# EAGLE design board (EAGLE 9.5.1)
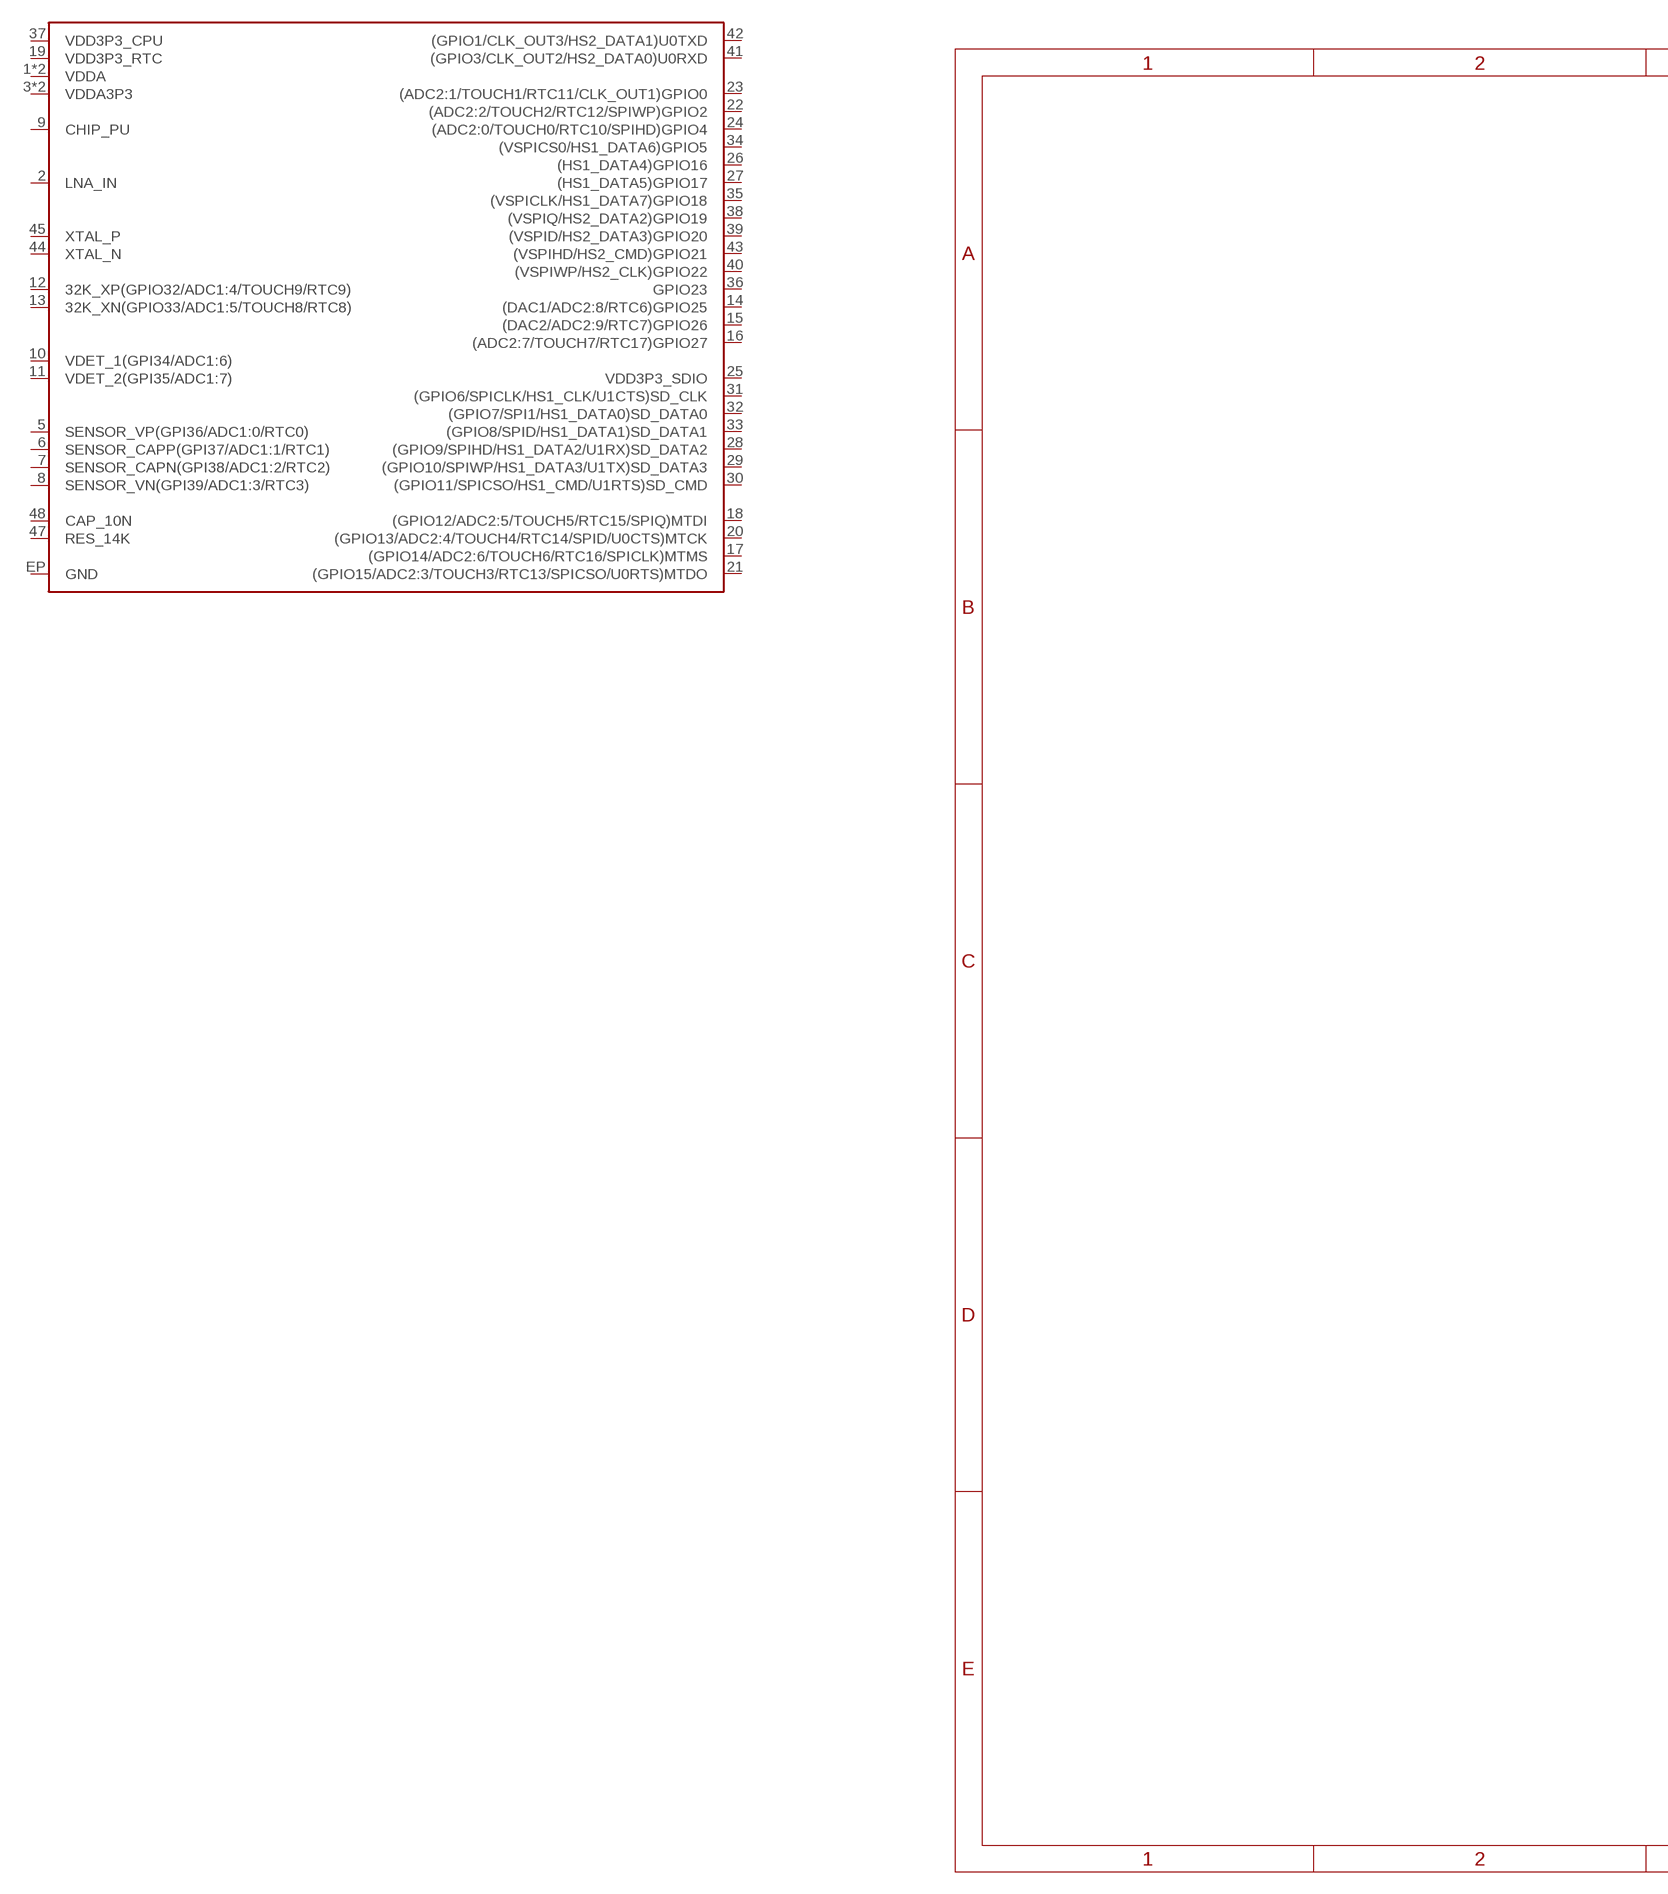
[diagram p0: schematic, sheet 1, part 1 of 2]
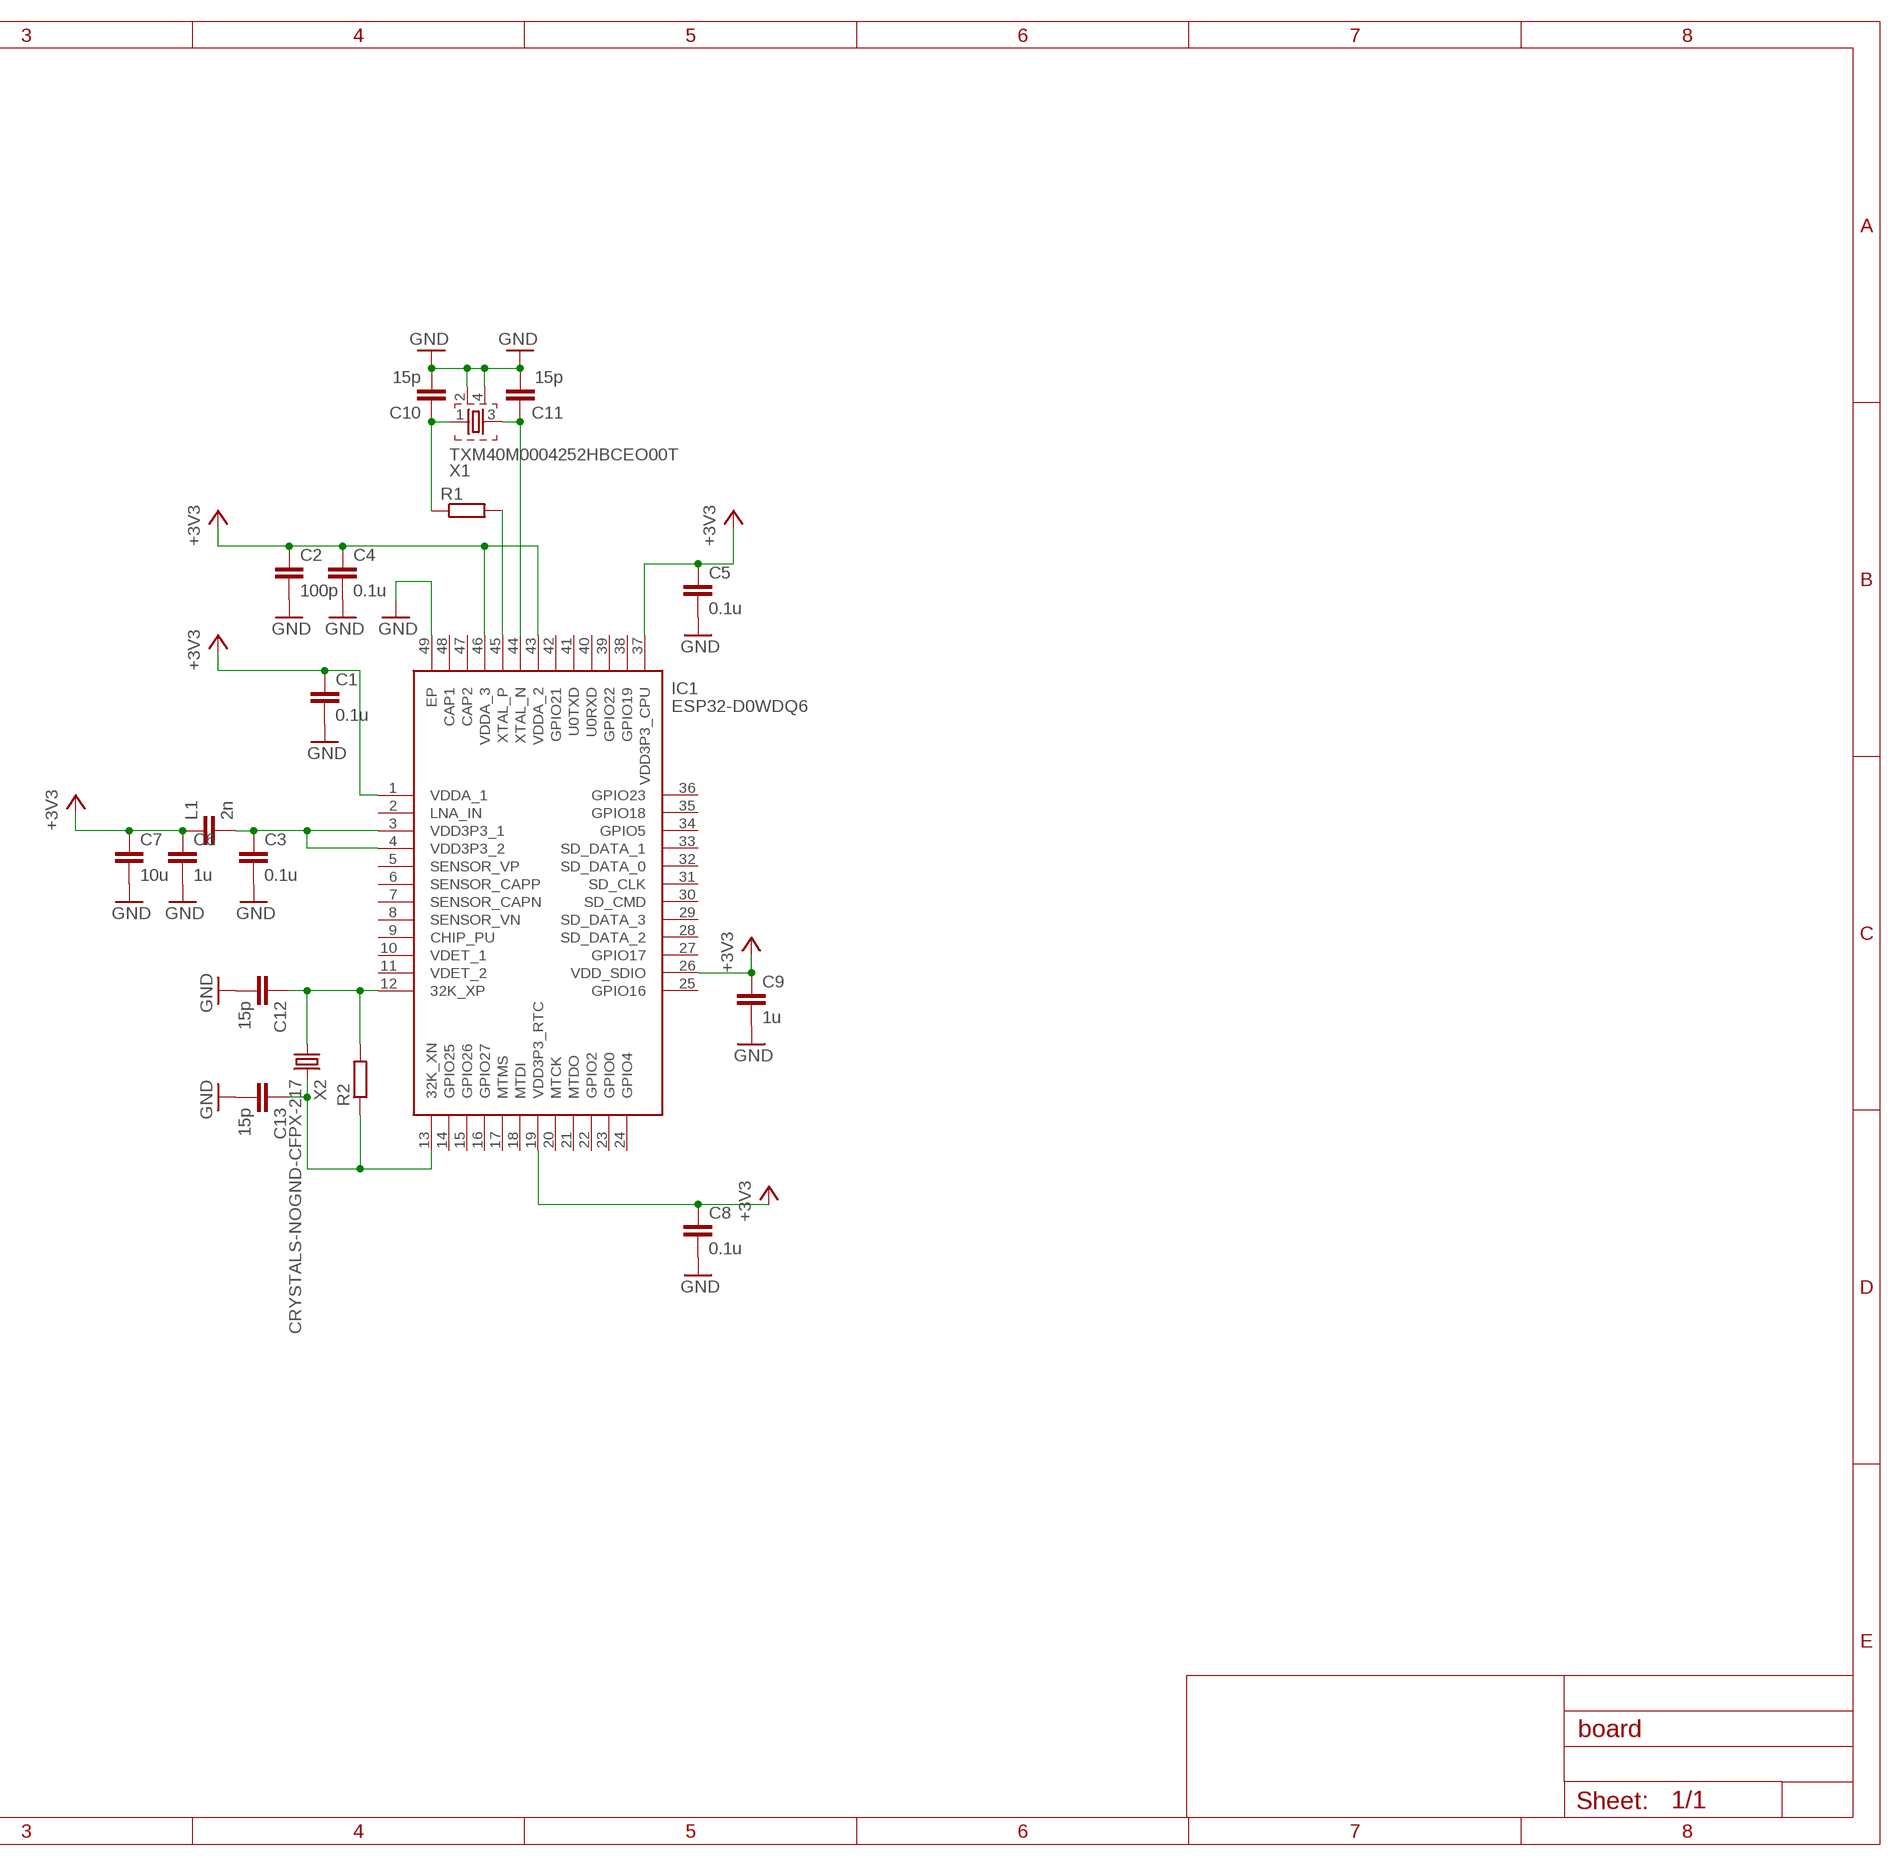
[diagram p1: schematic, sheet 1, part 2 of 2]

## Parts
C1  0.1u  C-EUC0402  [C0402]
C2  100p  C-EUC0402  [C0402]
C3  0.1u  C-EUC0402  [C0402]
C4  0.1u  C-EUC0402  [C0402]
C5  0.1u  C-EUC0402  [C0402]
C6  1u  C-EUC0402  [C0402]
C7  10u  C-EUC0603  [C0603]
C8  0.1u  C-EUC0402  [C0402]
C9  1u  C-EUC0402  [C0402]
C10  15p  C-EUC0402  [C0402]
C11  15p  C-EUC0402  [C0402]
C12  15p  C-EUC0402  [C0402]
C13  15p  C-EUC0402  [C0402]
IC1  ESP32-D0WDQ6  [QFN40P600X600X90-49N]
L1  2n  C-EUC0402K  [C0402K]
R1  R-EU_R0402  [R0402]
R2  R-EU_R0402  [R0402]
U$1  ESP32  [QFN48-0.4MM]
X1  TXM40M0004252HBCEO00T  CRYSTALS-GND-LID-CFPX-181  [2.5X2-4-PAD]
X2  CRYSTALS-NOGND-CFPX-217  [3.2X1.5-2-PAD]

## Nets
+3V3: C1.1 C2.1 C4.1 C5.1 C6.1 C7.1 C8.1 C9.1 IC1.1(VDDA_1) IC1.19(VDD3P3_RTC) IC1.26(VDD_SDIO) IC1.37(VDD3P3_CPU) IC1.43(VDDA_2) IC1.46(VDDA_3) L1.1
GND: C1.2 C2.2 C3.2 C4.2 C5.2 C6.2 C7.2 C8.2 C9.2 C10.2 C11.2 C12.2 C13.2 IC1.49(EP) X1.2 X1.4
N$2: C10.1 R1.1 X1.1
N$3: C3.1 IC1.3(VDD3P3_1) IC1.4(VDD3P3_2) L1.2
N$4: C11.1 IC1.44(XTAL_N) X1.3
N$5: IC1.45(XTAL_P) R1.2
N$6: C12.1 IC1.12(32K_XP) R2.2 X2.1
N$7: C13.1 IC1.13(32K_XN) R2.1 X2.2
Unconnected: IC1.2(LNA_IN) IC1.5(SENSOR_VP) IC1.6(SENSOR_CAPP) IC1.7(SENSOR_CAPN) IC1.8(SENSOR_VN) IC1.9(CHIP_PU) IC1.10(VDET_1) IC1.11(VDET_2) IC1.14(GPIO25) IC1.15(GPIO26) IC1.16(GPIO27) IC1.17(MTMS) IC1.18(MTDI) IC1.20(MTCK) IC1.21(MTDO) IC1.22(GPIO2) IC1.23(GPIO0) IC1.24(GPIO4) IC1.25(GPIO16) IC1.27(GPIO17) IC1.28(SD_DATA_2) IC1.29(SD_DATA_3) IC1.30(SD_CMD) IC1.31(SD_CLK) IC1.32(SD_DATA_0) IC1.33(SD_DATA_1) IC1.34(GPIO5) IC1.35(GPIO18) IC1.36(GPIO23) IC1.38(GPIO19) IC1.39(GPIO22) IC1.40(U0RXD) IC1.41(U0TXD) IC1.42(GPIO21) IC1.47(CAP2) IC1.48(CAP1) U$1.1(VDDA) U$1.2(LNA_IN) U$1.3(VDDA3P3) U$1.4(VDDA3P3) U$1.5(SENSOR_VP(GPI36/ADC1:0/RTC0)) U$1.6(SENSOR_CAPP(GPI37/ADC1:1/RTC1)) U$1.7(SENSOR_CAPN(GPI38/ADC1:2/RTC2)) U$1.8(SENSOR_VN(GPI39/ADC1:3/RTC3)) U$1.9(CHIP_PU) U$1.10(VDET_1(GPI34/ADC1:6)) U$1.11(VDET_2(GPI35/ADC1:7)) U$1.12(32K_XP(GPIO32/ADC1:4/TOUCH9/RTC9)) U$1.13(32K_XN(GPIO33/ADC1:5/TOUCH8/RTC8)) U$1.14((DAC1/ADC2:8/RTC6)GPIO25) U$1.15((DAC2/ADC2:9/RTC7)GPIO26) U$1.16((ADC2:7/TOUCH7/RTC17)GPIO27) U$1.17((GPIO14/ADC2:6/TOUCH6/RTC16/SPICLK)MTMS) U$1.18((GPIO12/ADC2:5/TOUCH5/RTC15/SPIQ)MTDI) U$1.19(VDD3P3_RTC) U$1.20((GPIO13/ADC2:4/TOUCH4/RTC14/SPID/U0CTS)MTCK) U$1.21((GPIO15/ADC2:3/TOUCH3/RTC13/SPICSO/U0RTS)MTDO) U$1.22((ADC2:2/TOUCH2/RTC12/SPIWP)GPIO2) U$1.23((ADC2:1/TOUCH1/RTC11/CLK_OUT1)GPIO0) U$1.24((ADC2:0/TOUCH0/RTC10/SPIHD)GPIO4) U$1.25(VDD3P3_SDIO) U$1.26((HS1_DATA4)GPIO16) U$1.27((HS1_DATA5)GPIO17) U$1.28((GPIO9/SPIHD/HS1_DATA2/U1RX)SD_DATA2) U$1.29((GPIO10/SPIWP/HS1_DATA3/U1TX)SD_DATA3) U$1.30((GPIO11/SPICSO/HS1_CMD/U1RTS)SD_CMD) U$1.31((GPIO6/SPICLK/HS1_CLK/U1CTS)SD_CLK) U$1.32((GPIO7/SPI1/HS1_DATA0)SD_DATA0) U$1.33((GPIO8/SPID/HS1_DATA1)SD_DATA1) U$1.34((VSPICS0/HS1_DATA6)GPIO5) U$1.35((VSPICLK/HS1_DATA7)GPIO18) U$1.36(GPIO23) U$1.37(VDD3P3_CPU) U$1.38((VSPIQ/HS2_DATA2)GPIO19) U$1.39((VSPID/HS2_DATA3)GPIO20) U$1.40((VSPIWP/HS2_CLK)GPIO22) U$1.41((GPIO3/CLK_OUT2/HS2_DATA0)U0RXD) U$1.42((GPIO1/CLK_OUT3/HS2_DATA1)U0TXD) U$1.43((VSPIHD/HS2_CMD)GPIO21) U$1.44(XTAL_N) U$1.45(XTAL_P) U$1.46(VDDA) U$1.47(RES_14K) U$1.48(CAP_10N) U$1.EP(GND)

## Library data of the parts
C1-C13 L1 = rcl:C-EU: CAPACITOR, European symbol; SPICEPREFIX: C
IC1 = SamacSys_Parts:ESP32-D0WDQ6: RF System on a Chip - SoC SMD IC ESP32-D0WDQ6, Dual Core MCU, WiFi & Bluetooth Combo, QFN48-pin, 6x6mm Source: Datasheet <https://componentsearchengine.com/Datasheets/1/ESP32-D0WDQ6.pdf>; DESCRIPTION: RF System on a Chip - SoC SMD IC ESP32-D0WDQ6, Dual Core MCU, WiFi & Bluetooth Combo, QFN48-pin, 6x6mm; HEIGHT: 0.9mm; MANUFACTURER_NAME: Espressif Systems; MANUFACTURER_PART_NUMBER: ESP32-D0WDQ6; MOUSER_PART_NUMBER: 356-ESP32-D0WDQ6; MOUSER_PRICE-STOCK: https://www.mouser.co.uk/ProductDetail/Espressif-Systems/ESP32-D0WDQ6?qs=chTDxNqvsykWgzfXx0gR%252BQ%3D%3D
R1 R2 = rcl:R-EU_: RESISTOR, European symbol; SPICEPREFIX: R
U$1 = esp32:ESP32
X1 = IQD-Frequency-Products:CRYSTALS-GND-LID: CRYSTALS WITH CAN GROUNDED
X2 = IQD-Frequency-Products:CRYSTALS-NOGND: CRYSTALS CAN NOT GROUNDED

## Board
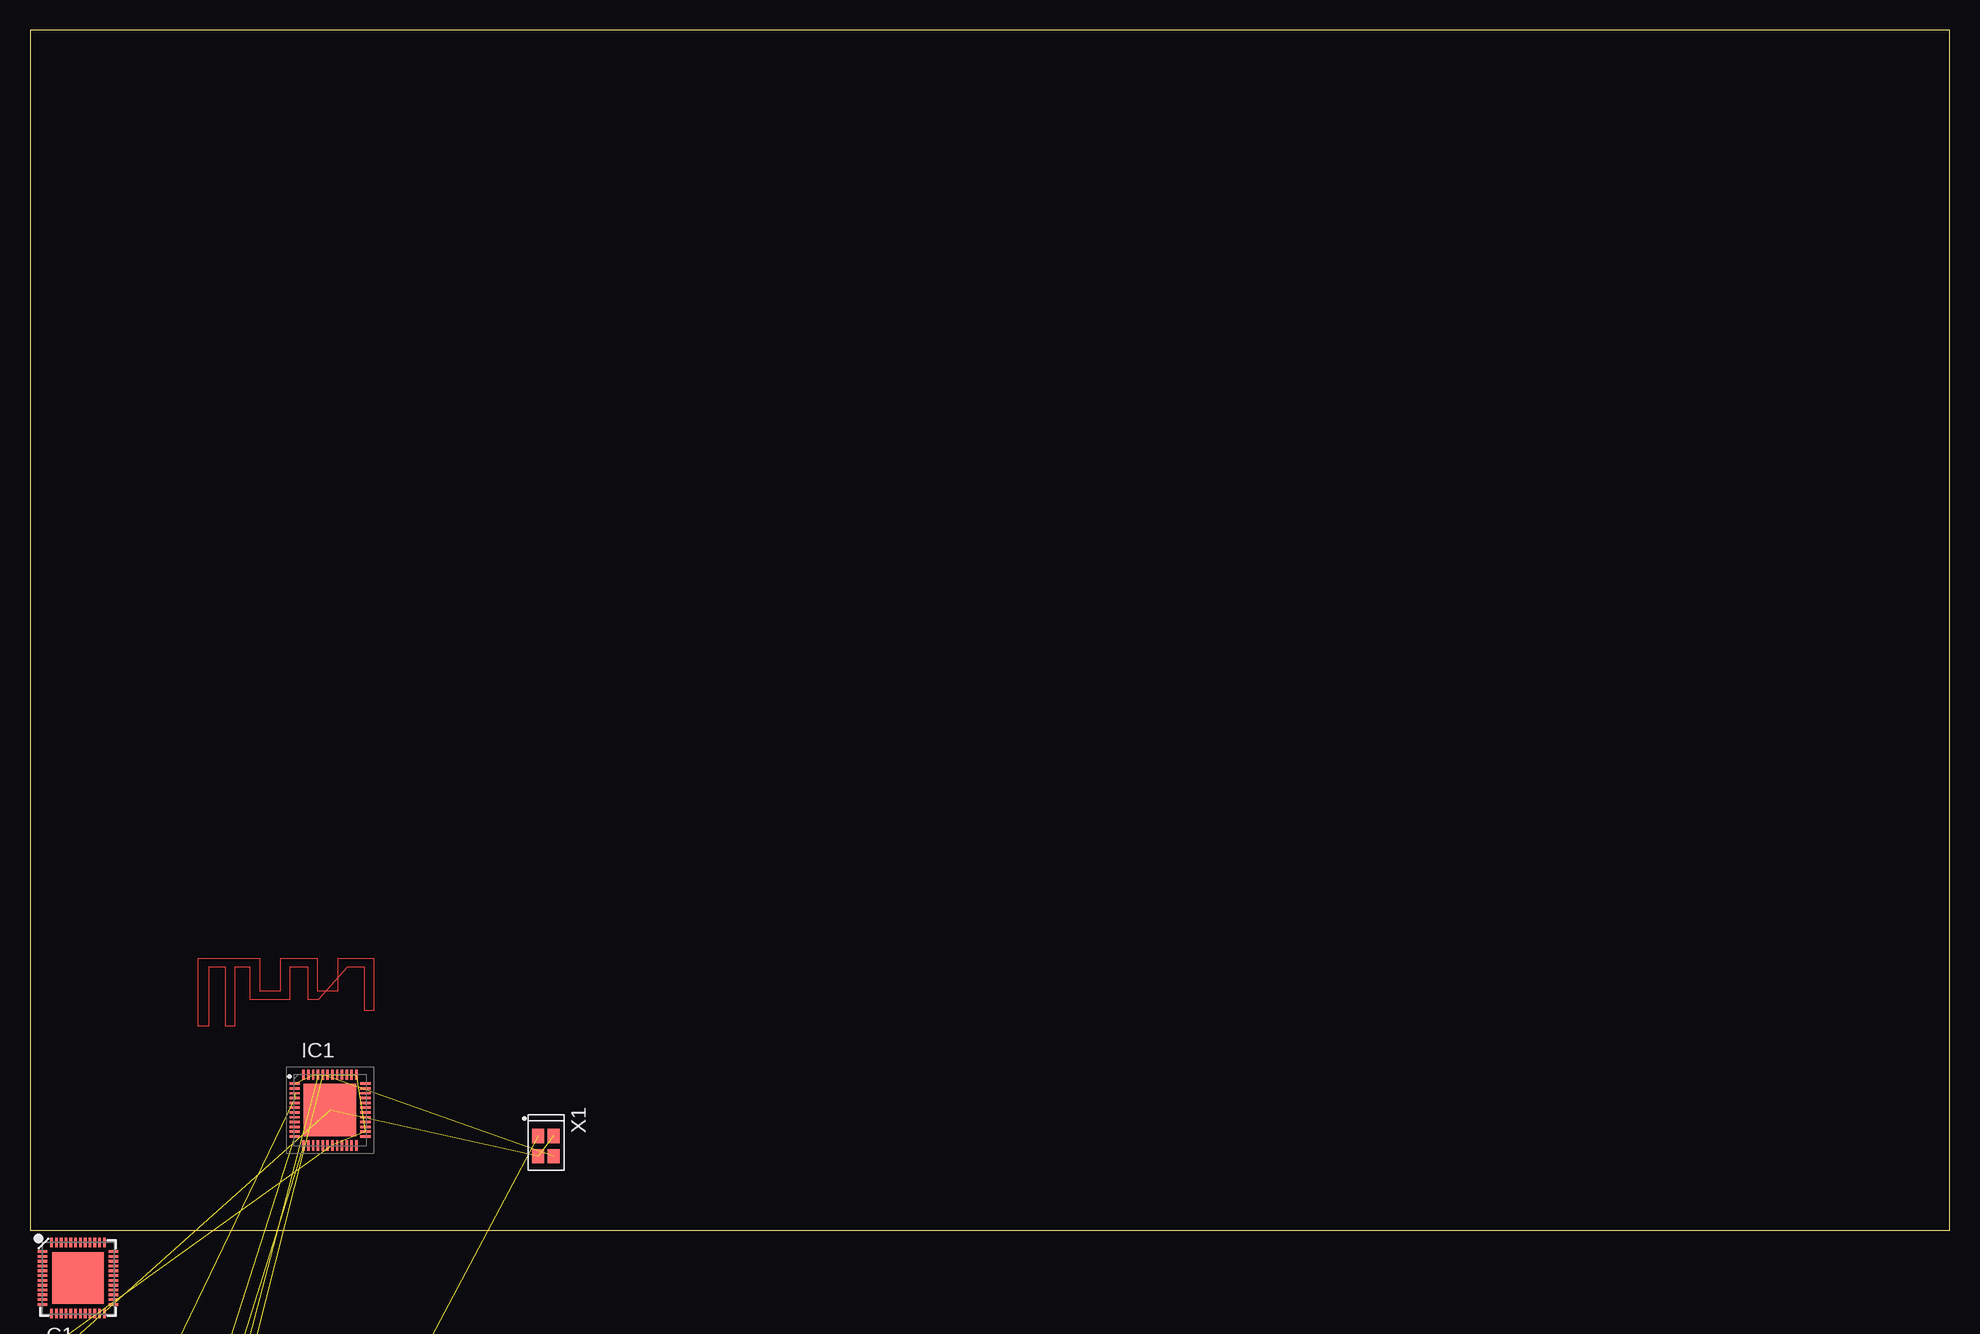
[diagram p2: board, top side]

Size 160 x 100 mm. Coordinates in mm from the lower left corner, seen from the top.
Outline: 0,0 160,0 160,100 0,100 0,0
Copper layers (1+2*15+16): Top 0.035mm / dielectric 1.5mm / Route2 0.035mm / dielectric 0.15mm / Route15 0.035mm / dielectric 0.2mm / Bottom 0.035mm
Design rules "default *": minimum track width 6mil, minimum drill 0.35mm, track to track 0.15mm, track to pad 0.15mm, pad to pad 0.15mm, via to via 0.15mm, smd to smd 0.15mm, copper to edge 40mil, drill to drill 6mil, minimum pad ring 10mil, minimum via ring 8mil, stop-mask expansion 4mil, vias tented up to drill 0mil, thermal gap 10mil

### Footprints (pad centres in the part's own frame; a part is rotated, then mirrored left to right if it is on the bottom)
C0402 = smd 0.7 x 0.9: 1 -0.65,0; 2 0.65,0
C0603 = smd 1.1 x 1: 1 -0.85,0; 2 0.85,0
QFN40P600X600X90-49N = smd 0.85 x 0.2: 1 -2.95,2.2; 2 -2.95,1.8; 3 -2.95,1.4; 4 -2.95,1; 5 -2.95,0.6; 6 -2.95,0.2; 7 -2.95,-0.2; 8 -2.95,-0.6; 9 -2.95,-1; 10 -2.95,-1.4; 11 -2.95,-1.8; 12 -2.95,-2.2; 25 2.95,-2.2; 26 2.95,-1.8; 27 2.95,-1.4; 28 2.95,-1; 29 2.95,-0.6; 30 2.95,-0.2; 31 2.95,0.2; 32 2.95,0.6; 33 2.95,1; 34 2.95,1.4; 35 2.95,1.8; 36 2.95,2.2 | smd 0.2 x 0.85: 13 -2.2,-2.95; 14 -1.8,-2.95; 15 -1.4,-2.95; 16 -1,-2.95; 17 -0.6,-2.95; 18 -0.2,-2.95; 19 0.2,-2.95; 20 0.6,-2.95; 21 1,-2.95; 22 1.4,-2.95; 23 1.8,-2.95; 24 2.2,-2.95; 37 2.2,2.95; 38 1.8,2.95; 39 1.4,2.95; 40 1,2.95; 41 0.6,2.95; 42 0.2,2.95; 43 -0.2,2.95; 44 -0.6,2.95; 45 -1,2.95; 46 -1.4,2.95; 47 -1.8,2.95; 48 -2.2,2.95 | smd 4.35 x 4.35: 49 0,0
C0402K = smd 0.925 x 0.74: 1 -0.6,0; 2 0.6,0
R0402 = smd 0.6 x 0.7: 1 -0.5,0; 2 0.5,0
QFN48-0.4MM = smd 0.8 x 0.23: 1 -2.95,2.2; 2 -2.95,1.8; 3 -2.95,1.4; 4 -2.95,1; 5 -2.95,0.6; 6 -2.95,0.2; 7 -2.95,-0.2; 8 -2.95,-0.6; 9 -2.95,-1; 10 -2.95,-1.4; 11 -2.95,-1.8; 12 -2.95,-2.2; 25 2.95,-2.2; 26 2.95,-1.8; 27 2.95,-1.4; 28 2.95,-1; 29 2.95,-0.6; 30 2.95,-0.2; 31 2.95,0.2; 32 2.95,0.6; 33 2.95,1; 34 2.95,1.4; 35 2.95,1.8; 36 2.95,2.2 | smd 0.23 x 0.8: 13 -2.2,-2.95; 14 -1.8,-2.95; 15 -1.4,-2.95; 16 -1,-2.95; 17 -0.6,-2.95; 18 -0.2,-2.95; 19 0.2,-2.95; 20 0.6,-2.95; 21 1,-2.95; 22 1.4,-2.95; 23 1.8,-2.95; 24 2.2,-2.95; 37 2.2,2.95; 38 1.8,2.95; 39 1.4,2.95; 40 1,2.95; 41 0.6,2.95; 42 0.2,2.95; 43 -0.2,2.95; 44 -0.6,2.95; 45 -1,2.95; 46 -1.4,2.95; 47 -1.8,2.95; 48 -2.2,2.95 | smd 4.3 x 4.3: EP 0,0
2.5X2-4-PAD = smd 1.2 x 1: 1 -0.85,-0.65; 2 0.85,-0.65; 3 0.85,0.65; 4 -0.85,0.65
3.2X1.5-2-PAD = smd 1.1 x 1.9: 1 -1.25,0; 2 1.25,0

### Placement (x,y rotation side)
C1  2,-10 0 top  (outside the outline)
C2  2,-27 0 top  (outside the outline)
C3  2,-32 0 top  (outside the outline)
C4  2,-22 0 top  (outside the outline)
C5  2,-37 0 top  (outside the outline)
C6  2,-49 0 top  (outside the outline)
C7  2,-54 0 top  (outside the outline)
C8  2,-59 0 top  (outside the outline)
C9  2,-64 0 top  (outside the outline)
C10  2,-73 0 top  (outside the outline)
C11  2,-78 0 top  (outside the outline)
C12  -6.3,-82.9 0 top  (outside the outline)
C13  -6.3,-87.8 0 top  (outside the outline)
IC1  25,10 0 top
L1  2,-44 0 top  (outside the outline)
R1  2,-69 0 top  (outside the outline)
R2  -6.6,-92.7 0 top  (outside the outline)
U$1  4,-4 0 top
X1  43,7 270 top
X2  -3.2,-98.4 0 top  (outside the outline)

### Tracks (layer width: path | path; a pad name or v marks a point on that pad's centre or on a via)
+3V3  (14 unrouted)
GND  (15 unrouted)
N$1
  Top 0.001: 14,22.65 19.13,22.65 19.13,19.95 20.88,19.95 20.88,22.65 23.94,22.65 23.94,19.95 25.68,19.95 25.68,22.65 28.64,22.65 28.64,18.27 27.88,18.27 27.88,21.9 26.44,21.9 24,19.2 23.18,19.2 23.18,21.9 21.64,21.9 21.64,19.2 18.37,19.2 18.37,21.9 17.05,21.9 17.05,17 16.3,17 16.3,21.9 14.88,21.9 14.88,17 14,17 14,22.65
N$2  (2 unrouted)
N$3  (3 unrouted)
N$4  (2 unrouted)
N$5  (1 unrouted)
N$6  (3 unrouted)
N$7  (3 unrouted)